# Altium project TFT_BORAD.PrjPcb
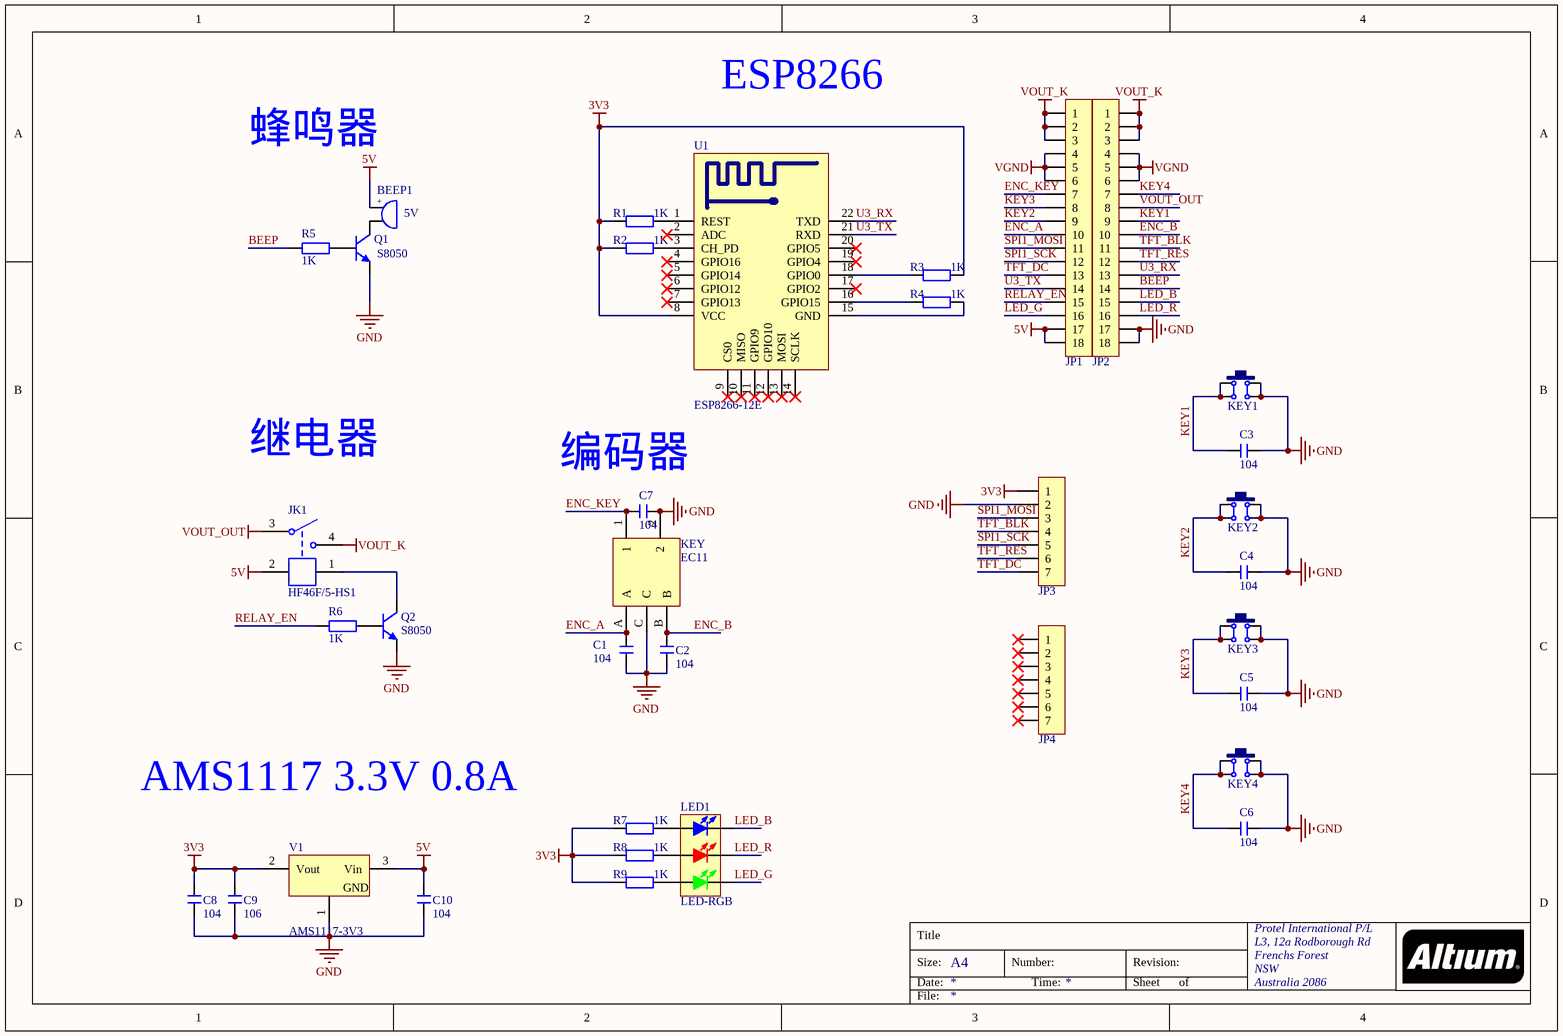
[diagram p0: TFT_BORAD.SchDoc]
1 sheet, 35 parts. Net scope: global (net labels, ports and power ports of the same name join across sheets).
Board file: TFT_BORAD.PcbDoc

## Sheet TFT_BORAD.SchDoc
size A4; Organization: Protel International P/L; Address1: L3, 12a Rodborough Rd; Address2: Frenchs Forest; Address3: NSW; Address4: Australia 2086

### Parts
BEEP1  5V  [BEEP 6.5x12x8.5]
C1  104  [C 0603_M]
C2  104  [C 0603_M]
C3  104  [C 0603_M]
C4  104  [C 0603_M]
C5  104  [C 0603_M]
C6  104  [C 0603_M]
C7  104  [C 0603_M]
C8  104  [C 0603_M]
C9  106  [C 0603_M]
C10  104  [C 0603_M]
JK1  HF46F/5-HS1  [HF46-xx-HS1]
JP1  HDR-1X18  [HDR2.54-M-LI-18P]  (value not drawn)
JP2  HDR-1X18  [HDR2.54-M-LI-18P]  (value not drawn)
JP3  HDR-1X7  [HDR2.54-LI-7P]  (value not drawn)
JP4  HDR-1X7  [HDR2.54-LI-7P]  (value not drawn)
KEY  EC11  [EC11]
KEY1  6x6x5  [TSW DIP-6*6*10]  (value not drawn)
KEY2  6x6x5  [TSW DIP-6*6*10]  (value not drawn)
KEY3  6x6x5  [TSW DIP-6*6*10]  (value not drawn)
KEY4  6x6x5  [TSW DIP-6*6*10]  (value not drawn)
LED1  LED-RGB  [LED 5050]
Q1  S8050  [SOT23-3M]
Q2  S8050  [SOT23-3M]
R1  1K  [R 0603_M]
R2  1K  [R 0603_M]
R3  1K  [R 0603_M]
R4  1K  [R 0603_M]
R5  1K  [R 0603_M]
R6  1K  [R 0603_M]
R7  1K  [R 0603_M]
R8  1K  [R 0603_M]
R9  1K  [R 0603_M]
U1  ESP8266-12E  [ESP_12E]
V1  AMS1117-3V3  [SOT223_L]

### Nets
3V3: C8.2 C9.2 JP3.1 R1.1 R2.1 R4.2 R7.2 R8.2 R9.2 U1.8(VCC) V1.2(Vout)
5V: BEEP1.1 C10.2 JK1.2 JP1.17 JP1.18 V1.3(Vin)
GND: C1.2 C2.2 C3.2 C4.2 C5.2 C6.2 C7.2 C8.1 C9.1 C10.1 JP2.17 JP2.18 JP3.2 KEY.2 KEY.C KEY1.2 KEY1.3 KEY2.2 KEY2.3 KEY3.2 KEY3.3 KEY4.2 KEY4.3 Q1.2(E) Q2.2(E) V1.1(GND)
VGND: JP1.4 JP1.5 JP1.6 JP2.4 JP2.5 JP2.6
VOUT_K: JK1.4 JP1.1 JP1.2 JP1.3 JP2.1 JP2.2 JP2.3
VOUT_OUT: JK1.3 JP2.8
BEEP: JP2.14 R5.2
ENC_A: C1.1 JP1.10 KEY.A
ENC_B: C2.1 JP2.10 KEY.B
ENC_KEY: C7.1 JP1.7 KEY.1
KEY1: C3.1 JP2.9 KEY1.1 KEY1.4
KEY2: C4.1 JP1.9 KEY2.1 KEY2.4
KEY3: C5.1 JP1.8 KEY3.1 KEY3.4
KEY4: C6.1 JP2.7 KEY4.1 KEY4.4
LED_B: JP2.15 LED1.6(BULE_K)
LED_G: JP1.16 LED1.4(GREEN_K)
LED_R: JP2.16 LED1.5(RED_K)
RELAY_EN: JP1.15 R6.2
SPI1_MOSI: JP1.11 JP3.3
SPI1_SCK: JP1.12 JP3.5
TFT_BLK: JP2.11 JP3.4
TFT_DC: JP1.13 JP3.7
TFT_RES: JP2.12 JP3.6
U3_RX: JP2.13 U1.22(TXD)
U3_TX: JP1.14 U1.21(RXD)
NetBEEP1_2: BEEP1.2 Q1.3(C)
NetJK1_1: JK1.1 Q2.3(C)
NetLED1_1: LED1.1(BULE_A) R7.1
NetLED1_2: LED1.2(RED_A) R8.1
NetLED1_3: LED1.3(GREEN_A) R9.1
NetQ1_1: Q1.1(B) R5.1
NetQ2_1: Q2.1(B) R6.1
NetR1_2: R1.2 U1.1(REST)
NetR2_2: R2.2 U1.3(CH_PD)
NetR3_1: R3.1 U1.16(GPIO15)
NetR3_2: R3.2 U1.15(GND)
NetR4_1: R4.1 U1.18(GPIO0)

Not connected (* = marked no-connect by the designer): JP4 1* 2* 3* 4* 5* 6* 7*; U1 2(ADC)* 4(GPIO16)* 5(GPIO14)* 6(GPIO12)* 7(GPIO13)* 9(CS0)* 10(MISO)* 11(GPIO9)* 12(GPIO10)* 13(MOSI)* 14(SCLK)* 17(GPIO2)* 19(GPIO4)* 20(GPIO5)*

### Notes on the sheet
- ESP8266
- 蜂鸣器
- 继电器
- (near C7) 编码器
- AMS1117 3.3V 0.8A
- Title
- Size:
- Date:
- A4
- Number:
- Time:
- Revision:
- Sheet
- of
- File:
- (in symbol BEEP) +

### Library data of the parts
BEEP1 = BEEP: 蜂鸣器; 版权归属: 源创客; BOM名称: 蜂鸣器; 学习资源: www.ooocke.com
C1-C10 = C: 无极性贴片电容; 版权归属: 源创客; BOM名称: 无极性贴片电容; 学习资源: www.ooocke.com
JK1 = HF46F/5-HS1: 5V一组常开; BOM名称: 5V继电器; 版权归属: 源创客; 学习资源: www.ooocke.com
JP1 JP2 = Header 18: 18P接插件; 版权归属: 源创客; BOM名称: 18P接插件; 学习资源: www.ooocke.com
JP3 JP4 = Header 7: 7P接插件; 版权归属: 源创客; BOM名称: 7P接插件; 学习资源: www.ooocke.com
KEY = EC11: 数字开关编码器; BOM名称: 数字编码开关; 版权归属: 源创客; 学习资源: www.ooocke.com
KEY1-KEY4 = TSW DIP-6x6: 直插6x6轻触开关; 版权归属: 源创客; BOM名称: 直插6x6轻触开关; 学习资源: www.ooocke.com
LED1 = LED-RGB: 三基色LED; pin to pad: 2>5 5>2; 版权归属: 源创客; BOM名称: 三基色LED; 学习资源: www.ooocke.com
Q1 Q2 = 8050-SMD: 高频放大-NPN型; 版权归属: 源创客; 属性: 40V 1.5A 1W 100MHZ; BOM名称: 高频放大-NPN型; 学习资源: www.ooocke.com
R1-R9 = R: 贴片电阻; 版权归属: 源创客; BOM名称: 贴片电阻; 学习资源: www.ooocke.com
U1 = ESP8266-12E: 串口 WIFI模块，ESP-12E; BOM名称: WIFI模块; 版权归属: 源创客; 学习资源: www.ooocke.com
V1 = AMS1117: 三端稳压芯片; BOM名称: 稳压芯片; 版权归属: 源创客; 学习资源: www.ooocke.com